# EAGLE design TA kontroller (EAGLE 6.2)
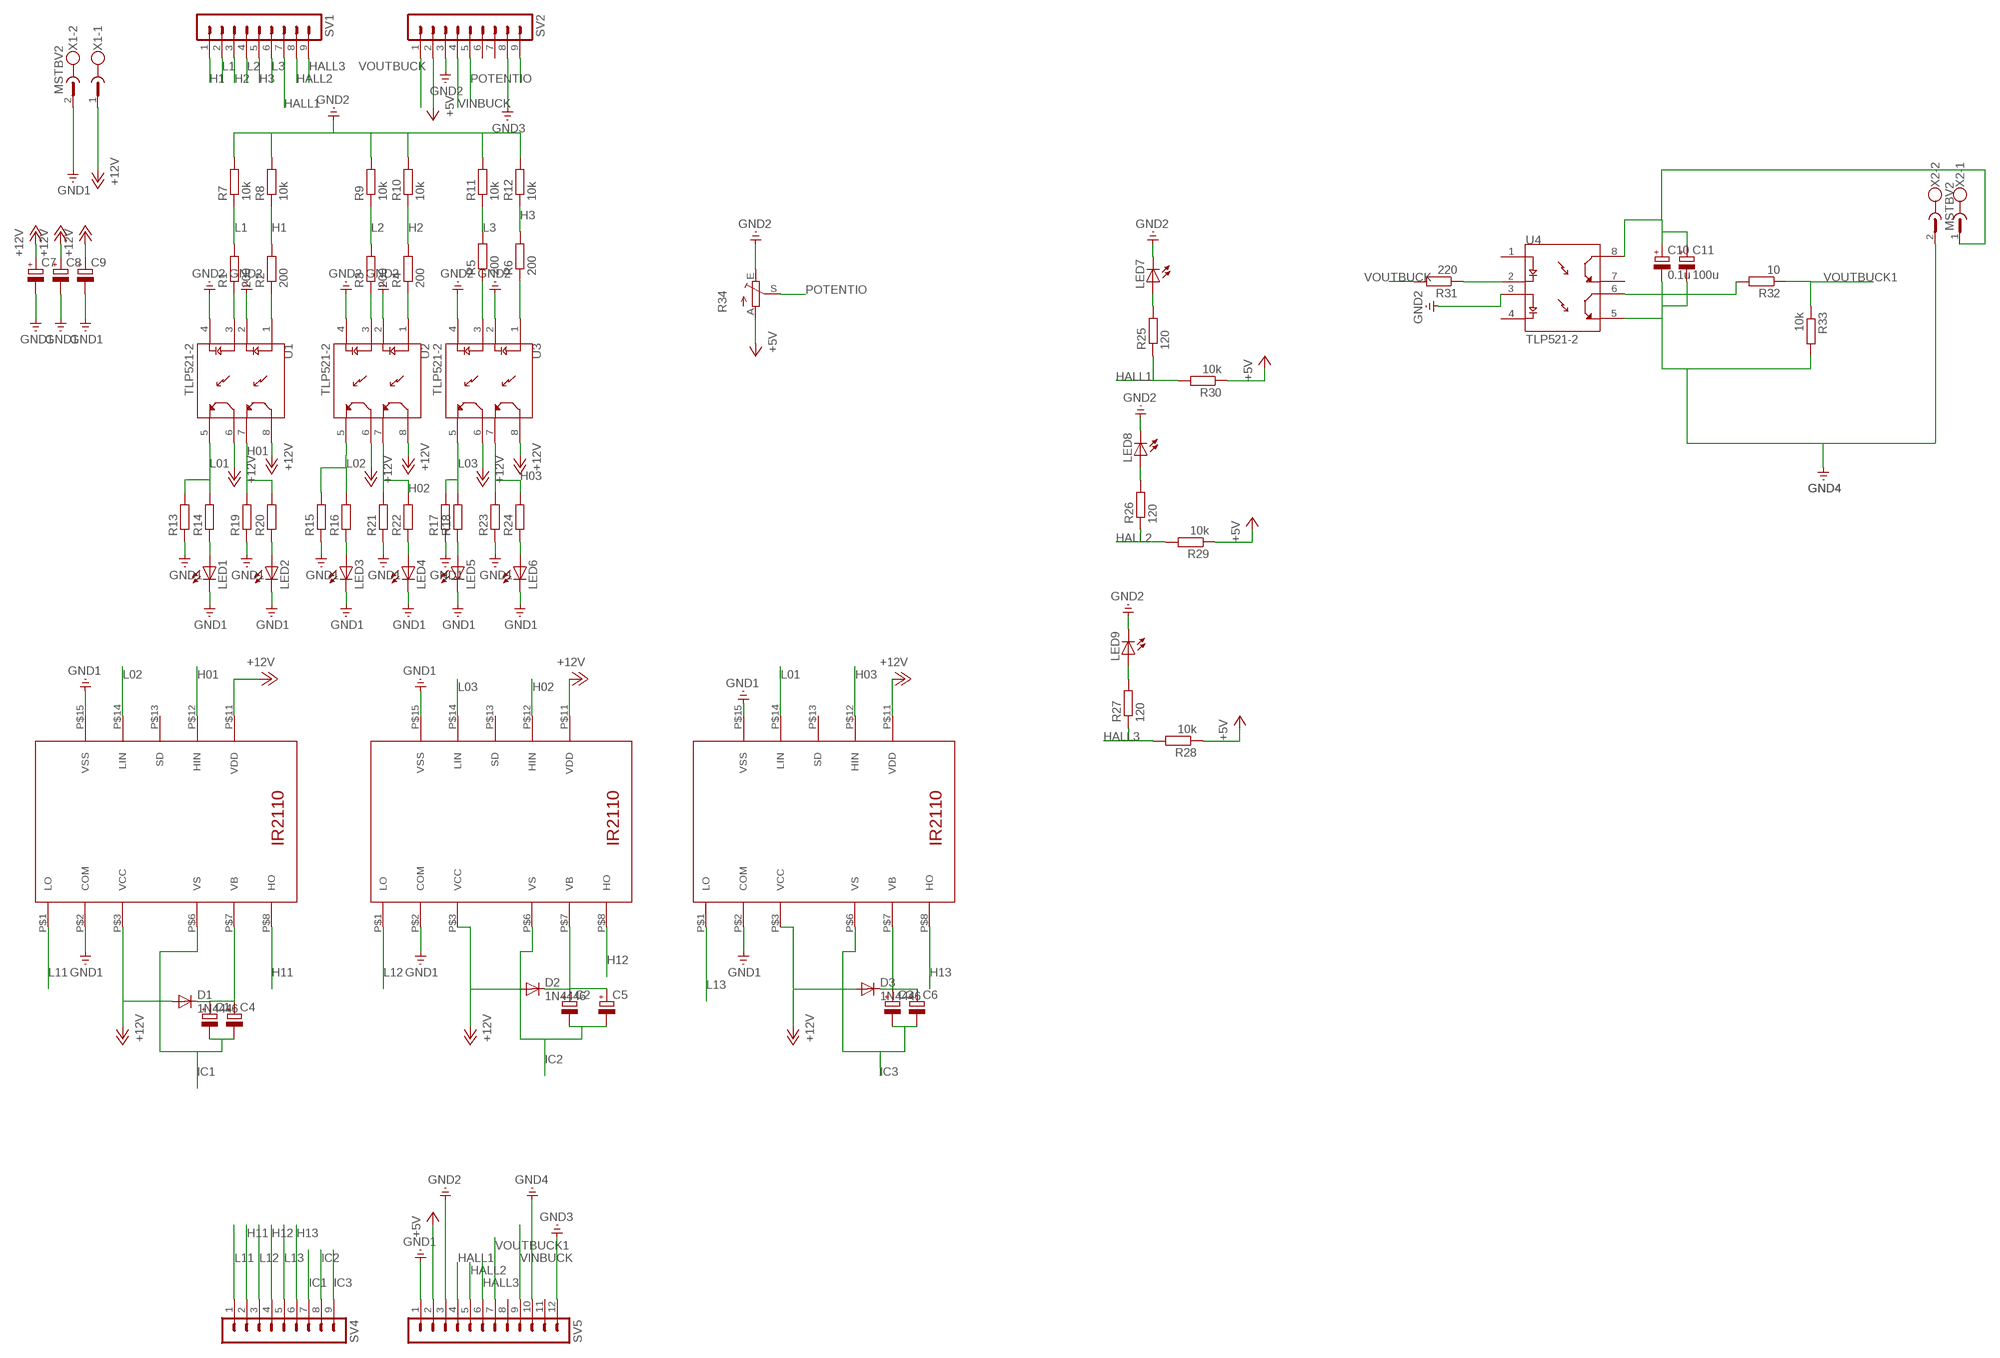
[diagram p0: schematic, sheet 1]

## Parts
C1  CPOL-EUB45181C  [B45181C]
C2  CPOL-EUB45181C  [B45181C]
C3  CPOL-EUB45181C  [B45181C]
C4  CPOL-EUB45181C  [B45181C]
C5  CPOL-EUB45181C  [B45181C]
C6  CPOL-EUB45181C  [B45181C]
C7  CPOL-EUB45181C  [B45181C]
C8  CPOL-EUB45181C  [B45181C]
C9  CPOL-EUB45181C  [B45181C]
C10  0.1u  CPOL-EUB45181C  [B45181C]
C11  100u  CPOL-EUB45181C  [B45181C]
D1  1N4446  [DO35-10]
D2  1N4446  [DO35-10]
D3  1N4446  [DO35-10]
LED1  LED3MM  [LED3MM]
LED2  LED3MM  [LED3MM]
LED3  LED3MM  [LED3MM]
LED4  LED3MM  [LED3MM]
LED5  LED3MM  [LED3MM]
LED6  LED3MM  [LED3MM]
LED7  LED3MM  [LED3MM]
LED8  LED3MM  [LED3MM]
LED9  LED3MM  [LED3MM]
R1  200  R-EU_0207/12  [0207/12]
R2  200  R-EU_0207/12  [0207/12]
R3  200  R-EU_0207/12  [0207/12]
R4  200  R-EU_0207/12  [0207/12]
R5  200  R-EU_0207/12  [0207/12]
R6  200  R-EU_0207/12  [0207/12]
R7  10k  R-EU_0207/12  [0207/12]
R8  10k  R-EU_0207/12  [0207/12]
R9  10k  R-EU_0207/12  [0207/12]
R10  10k  R-EU_0207/12  [0207/12]
R11  10k  R-EU_0207/12  [0207/12]
R12  10k  R-EU_0207/12  [0207/12]
R13  R-EU_0207/12  [0207/12]
R14  R-EU_0207/12  [0207/12]
R15  R-EU_0207/12  [0207/12]
R16  R-EU_0207/12  [0207/12]
R17  R-EU_0207/12  [0207/12]
R18  R-EU_0207/12  [0207/12]
R19  R-EU_0207/12  [0207/12]
R20  R-EU_0207/12  [0207/12]
R21  R-EU_0207/12  [0207/12]
R22  R-EU_0207/12  [0207/12]
R23  R-EU_0207/12  [0207/12]
R24  R-EU_0207/12  [0207/12]
R25  120  R-EU_0207/12  [0207/12]
R26  120  R-EU_0207/12  [0207/12]
R27  120  R-EU_0207/12  [0207/12]
R28  10k  R-EU_0207/12  [0207/12]
R29  10k  R-EU_0207/12  [0207/12]
R30  10k  R-EU_0207/12  [0207/12]
R31  220  R-EU_0207/12  [0207/12]
R32  10  R-EU_0207/12  [0207/12]
R33  10k  R-EU_0207/12  [0207/12]
R34  TRIM_EU-B25V  [B25V]
SV1  MA09-1  [MA09-1]
SV2  MA09-1  [MA09-1]
SV4  MA09-1  [MA09-1]
SV5  MA12-1  [MA12-1]
U1  TLP521-2  [DIP762W50P254L1018H451Q8]
U2  TLP521-2  [DIP762W50P254L1018H451Q8]
U3  TLP521-2  [DIP762W50P254L1018H451Q8]
U4  TLP521-2  [DIP762W50P254L1018H451Q8]
U$1  IR2110  [DIL16]
U$2  IR2110  [DIL16]
U$3  IR2110  [DIL16]
X1  MSTBV2  [MSTBV2]
X2  MSTBV2  [MSTBV2]

## Nets
+5V: R28.1 R29.1 R30.1 R34.A SV2.2 SV5.2
+12V: C7.+ C8.+ C9.+ D1.A D2.A D3.A U1.6 U1.8 U2.6 U2.8 U3.6 U3.8 U$1.P$3(VCC) U$1.P$11(VDD) U$2.P$3(VCC) U$2.P$11(VDD) U$3.P$3(VCC) U$3.P$11(VDD) X1.1
GND1: C7.- C8.- C9.- LED1.K(C) LED2.K(C) LED3.K(C) LED4.K(C) LED5.K(C) LED6.K(C) R13.1 R15.1 R17.1 R19.1 R21.1 R23.1 SV5.1 U$1.P$2(COM) U$1.P$15(VSS) U$2.P$2(COM) U$2.P$15(VSS) U$3.P$2(COM) U$3.P$15(VSS) X1.2
GND2: LED7.K(C) LED8.K(C) LED9.K(C) R7.2 R8.2 R9.2 R10.2 R11.2 R12.2 R34.E SV2.3 SV5.3 U1.2 U1.4 U2.2 U2.4 U3.2 U3.4 U4.3
GND3: SV2.8 SV5.12
GND4: C10.- C11.- R33.2 SV5.10 U4.5 X2.2
H1: R2.2 R8.1 SV1.1
H01: R19.2 R20.2 U1.7 U$1.P$12(HIN)
H2: R4.2 R10.1 SV1.3
H02: R21.2 R22.2 U2.7 U$2.P$12(HIN)
H3: R6.2 R12.1 SV1.5
H03: R23.2 R24.2 U3.7 U$3.P$12(HIN)
H11: SV4.2 U$1.P$8(HO)
H12: SV4.4 U$2.P$8(HO)
H13: SV4.6 U$3.P$8(HO)
HALL1: R25.1 R30.2 SV1.7 SV5.4
HALL2: R26.1 R29.2 SV1.8 SV5.5
HALL3: R27.1 R28.2 SV1.9 SV5.6
IC1: C1.- C4.- SV4.7 U$1.P$6(VS)
IC2: C2.- C5.- SV4.8 U$2.P$6(VS)
IC3: C3.- C6.- SV4.9 U$3.P$6(VS)
L1: R1.2 R7.1 SV1.2
L01: R13.2 R14.2 U1.5 U$3.P$14(LIN)
L2: R3.2 R9.1 SV1.4
L02: R15.2 R16.2 U2.5 U$1.P$14(LIN)
L3: R5.2 R11.1 SV1.6
L03: R17.2 R18.2 U3.5 U$2.P$14(LIN)
L11: SV4.1 U$1.P$1(LO)
L12: SV4.3 U$2.P$1(LO)
L13: SV4.5 U$3.P$1(LO)
N$1: R2.1 U1.1
N$2: R4.1 U2.1
N$3: R32.2 U4.6
N$4: R5.1 U3.3
N$5: R6.1 U3.1
N$6: LED1.A R14.1
N$7: LED2.A R20.1
N$8: LED3.A R16.1
N$9: LED4.A R22.1
N$10: R3.1 U2.3
N$11: R1.1 U1.3
N$12: LED5.A R18.1
N$13: LED6.A R24.1
N$14: R31.1 U4.2
N$15: C2.+ C5.+ D2.C U$2.P$7(VB)
N$16: C1.+ C4.+ D1.C U$1.P$7(VB)
N$17: C3.+ C6.+ D3.C U$3.P$7(VB)
N$18: LED9.A R27.2
N$19: LED8.A R26.2
N$20: LED7.A R25.2
POTENTIO: R34.S SV2.5
V2: C10.+ C11.+ SV2.9 U4.8 X2.1
VINBUCK: SV2.4 SV5.9
VOUTBUCK: R31.2 SV2.1
VOUTBUCK1: R32.1 R33.1 SV5.7
Unconnected: SV2.6 SV2.7 SV5.8 SV5.11 U4.1 U4.4 U4.7 U$1.P$13(SD) U$2.P$13(SD) U$3.P$13(SD)

## Library data of the parts
C1-C11 = rcl:CPOL-EU: POLARIZED CAPACITOR, European symbol
D1-D3 = diode:1N4446: DIODE high speed (Philips)
LED1-LED9 = led:LED: LED OSRAM: - CHIPLED LG R971, LG N971, LY N971, LG Q971, LY Q971, LO R971, LY R971 LH N974, LH R974 LS Q976, LO Q976, LY Q976 LO Q996 - Hyper CHIPLED LW Q18S LB Q993, LB Q99A, LB R99A - SideLED LS A670, LO A670, LY A670, LG A670, LP A670 LB A673, LV A673, LT A673, LW A673 LH A674 LY A675 LS A676, LA A676, LO A676, LY A676, LW A676 LS A679, LY A679, LG A679 - Hyper Micro SIDELED® LS Y876, LA Y876, LO Y876, LY Y876 LT Y87S - SmartLED LW L88C, LW L88S LB L89C, LB L89S, LG L890 LS L89K, LO L89K, LY L89K LS L896, LA L896, LO L896, LY L896 - TOPLED LS T670, LO T670, LY T670, LG T670, LP T670 LSG T670, LSP T670, LSY T670, LOP T670, LYG T670 LG T671, LOG T671, LSG T671 LB T673, LV T673, LT T673, LW T673 LH T674 LS T676, LA T676, LO T676, LY T676, LB T676, LH T676, LSB T676, LW T676 LB T67C, LV T67C, LT T67C, LS T67K, LO T67K, LY T67K, LW E67C LS E67B, LA E67B, LO E67B, LY E67B, LB E67C, LV E67C, LT E67C LW T67C LS T679, LY T679, LG T679 LS T770, LO T770, LY T770, LG T770, LP T770 LB T773, LV T773, LT T773, LW T773 LH T774 LS E675, LA E675, LY E675, LS T675 LS T776, LA T776, LO T776, LY T776, LB T776 LHGB T686 LT T68C, LB T68C - Hyper Mini TOPLED® LB M676 - Mini TOPLED Santana® LG M470 LS M47K, LO M47K, LY M47K Source: http://www.osram.convergy.de LUXEON: - LUMILED® LXK2-PW12-R00, LXK2-PW12-S00, LXK2-PW14-U00, LXK2-PW14-V00 LXK2-PM12-R00, LXK2-PM12-S00, LXK2-PM14-U00 LXK2-PE12-Q00, LXK2-PE12-R00, LXK2-PE12-S00, LXK2-PE14-T00, LXK2-PE14-U00 LXK2-PB12-K00, LXK2-PB12-L00, LXK2-PB12-M00, LXK2-PB14-N00, LXK2-PB14-P00, LXK2-PB14-Q00 LXK2-PR12-L00, LXK2-PR12-M00, LXK2-PR14-Q00, LXK2-PR14-R00 LXK2-PD12-Q00, LXK2-PD12-R00, LXK2-PD12-S00 LXK2-PH12-R00, LXK2-PH12-S00 LXK2-PL12-P00, LXK2-PL12-Q00, LXK2-PL12-R00 Source: www.luxeon.com KINGBRIGHT: KA-3528ASYC Source: www.kingbright.com
R1-R33 = rcl:R-EU_: RESISTOR, European symbol
R34 = pot:TRIM_EU-: POTENTIOMETER
SV1 SV2 SV4 = con-lstb:MA09-1: PIN HEADER; OC_FARNELL: unknown; OC_NEWARK: unknown
SV5 = con-lstb:MA12-1: PIN HEADER; OC_FARNELL: unknown; OC_NEWARK: unknown
U1-U4 = TLP521-2:TLP521-2: DIP-8 10 mm Leads Dual Channel 55 V 5300 Vrms Phototransistor Optocoupler; AVAILABILITY: Unavailable; DESCRIPTION: Optocoupler; THT; Channels: 2; Out: transistor; Uinsul: 5.3kV; DIP8; MF: Isocom; MP: TLP521-2; PACKAGE: DIP-8 Isocom; PRICE: None
U$1-U$3 = jfw-pwm1:IR2110
X1 X2 = con-phoenix-508:MSTBV2: PHOENIX; MPN: MSTBV 2,5/2-GF-5.08; OC_FARNELL: 1792792; OC_NEWARK: 69R9845

## Board
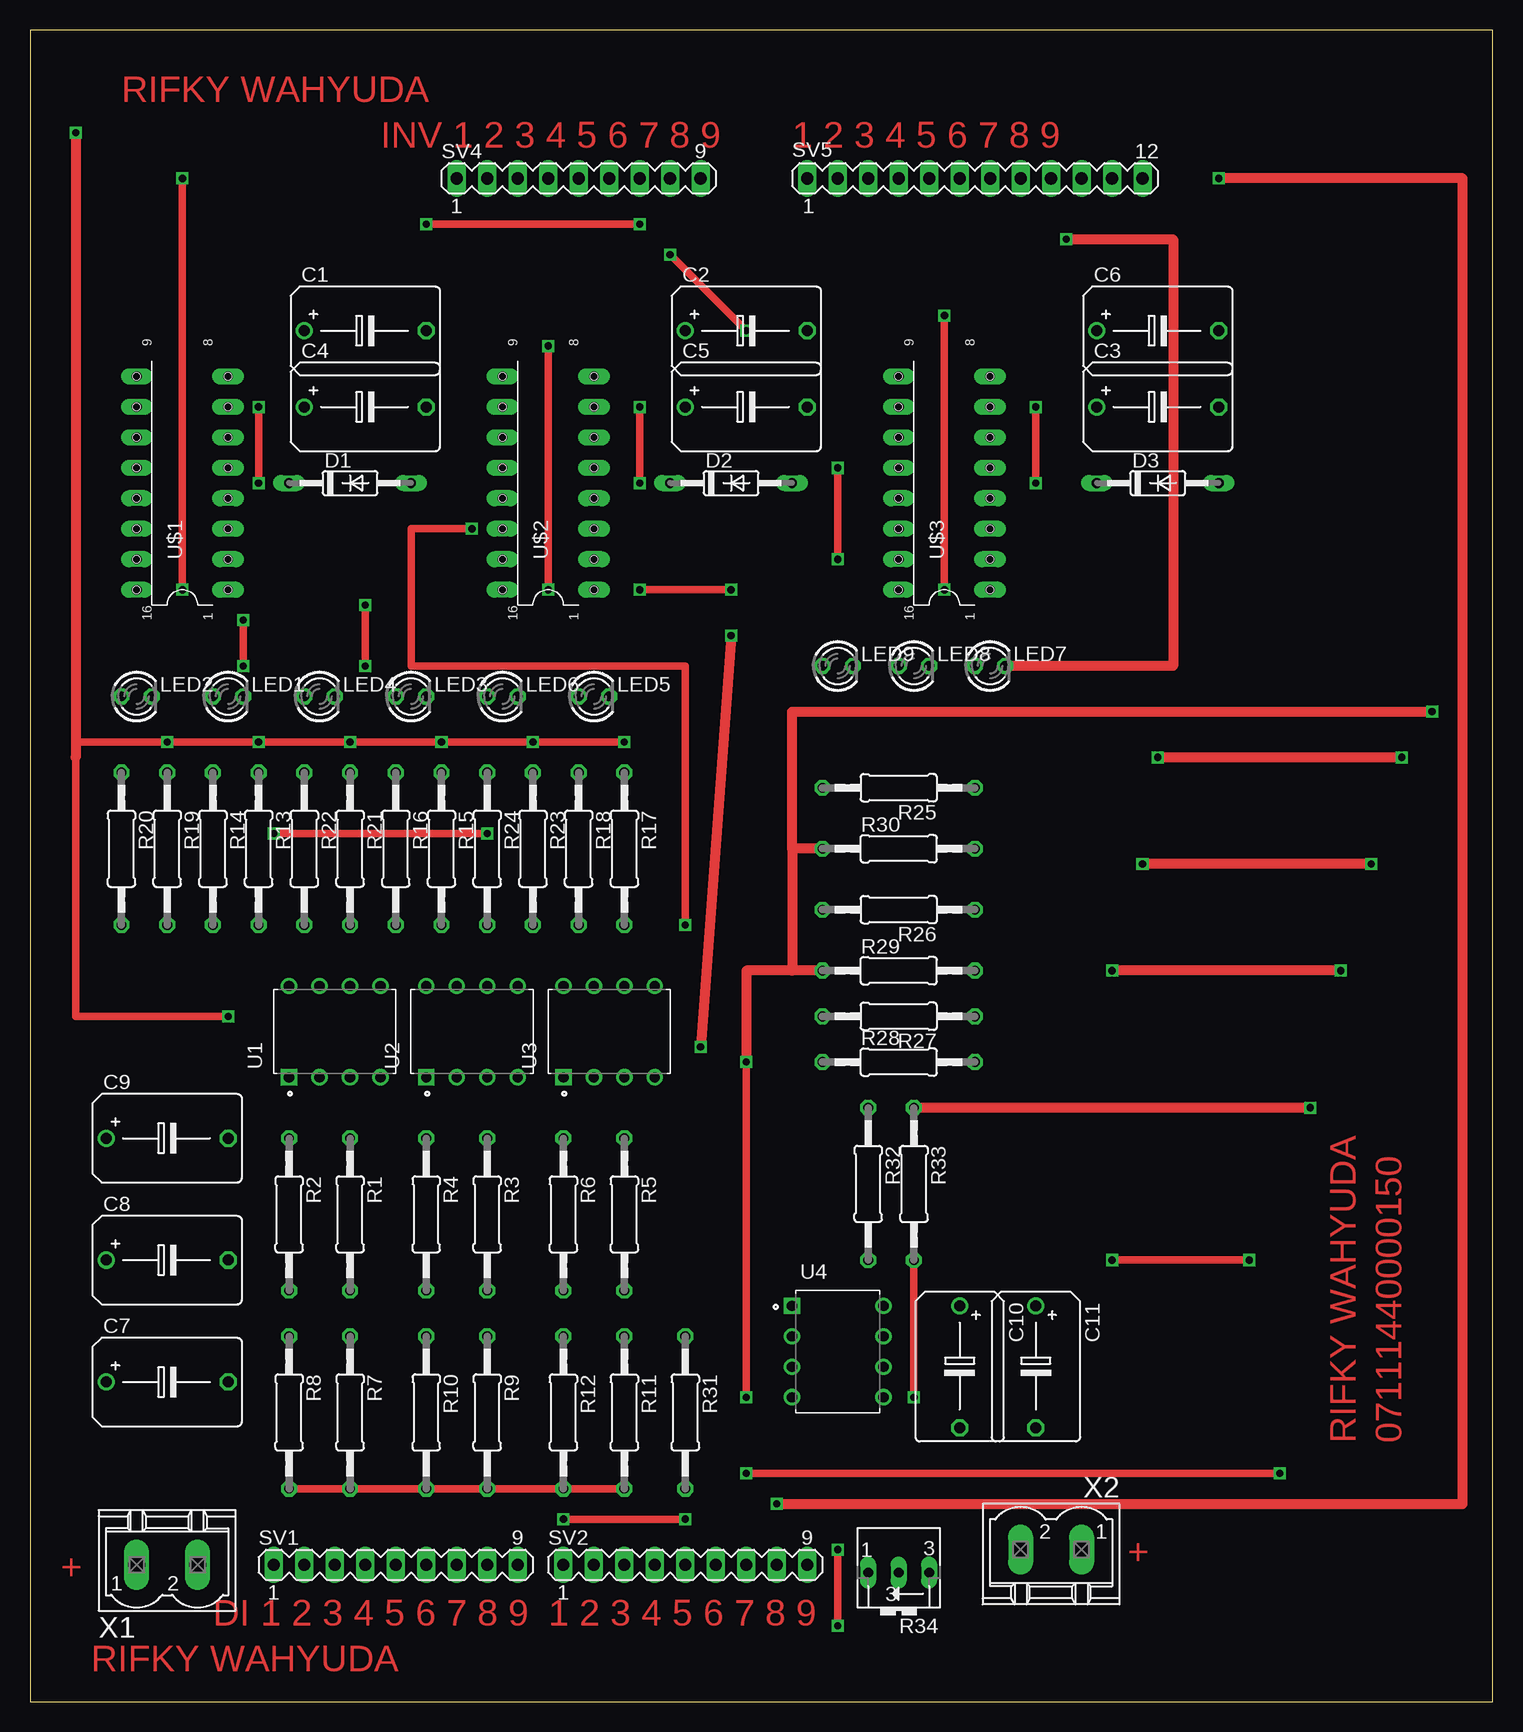
[diagram p1: board, top side]
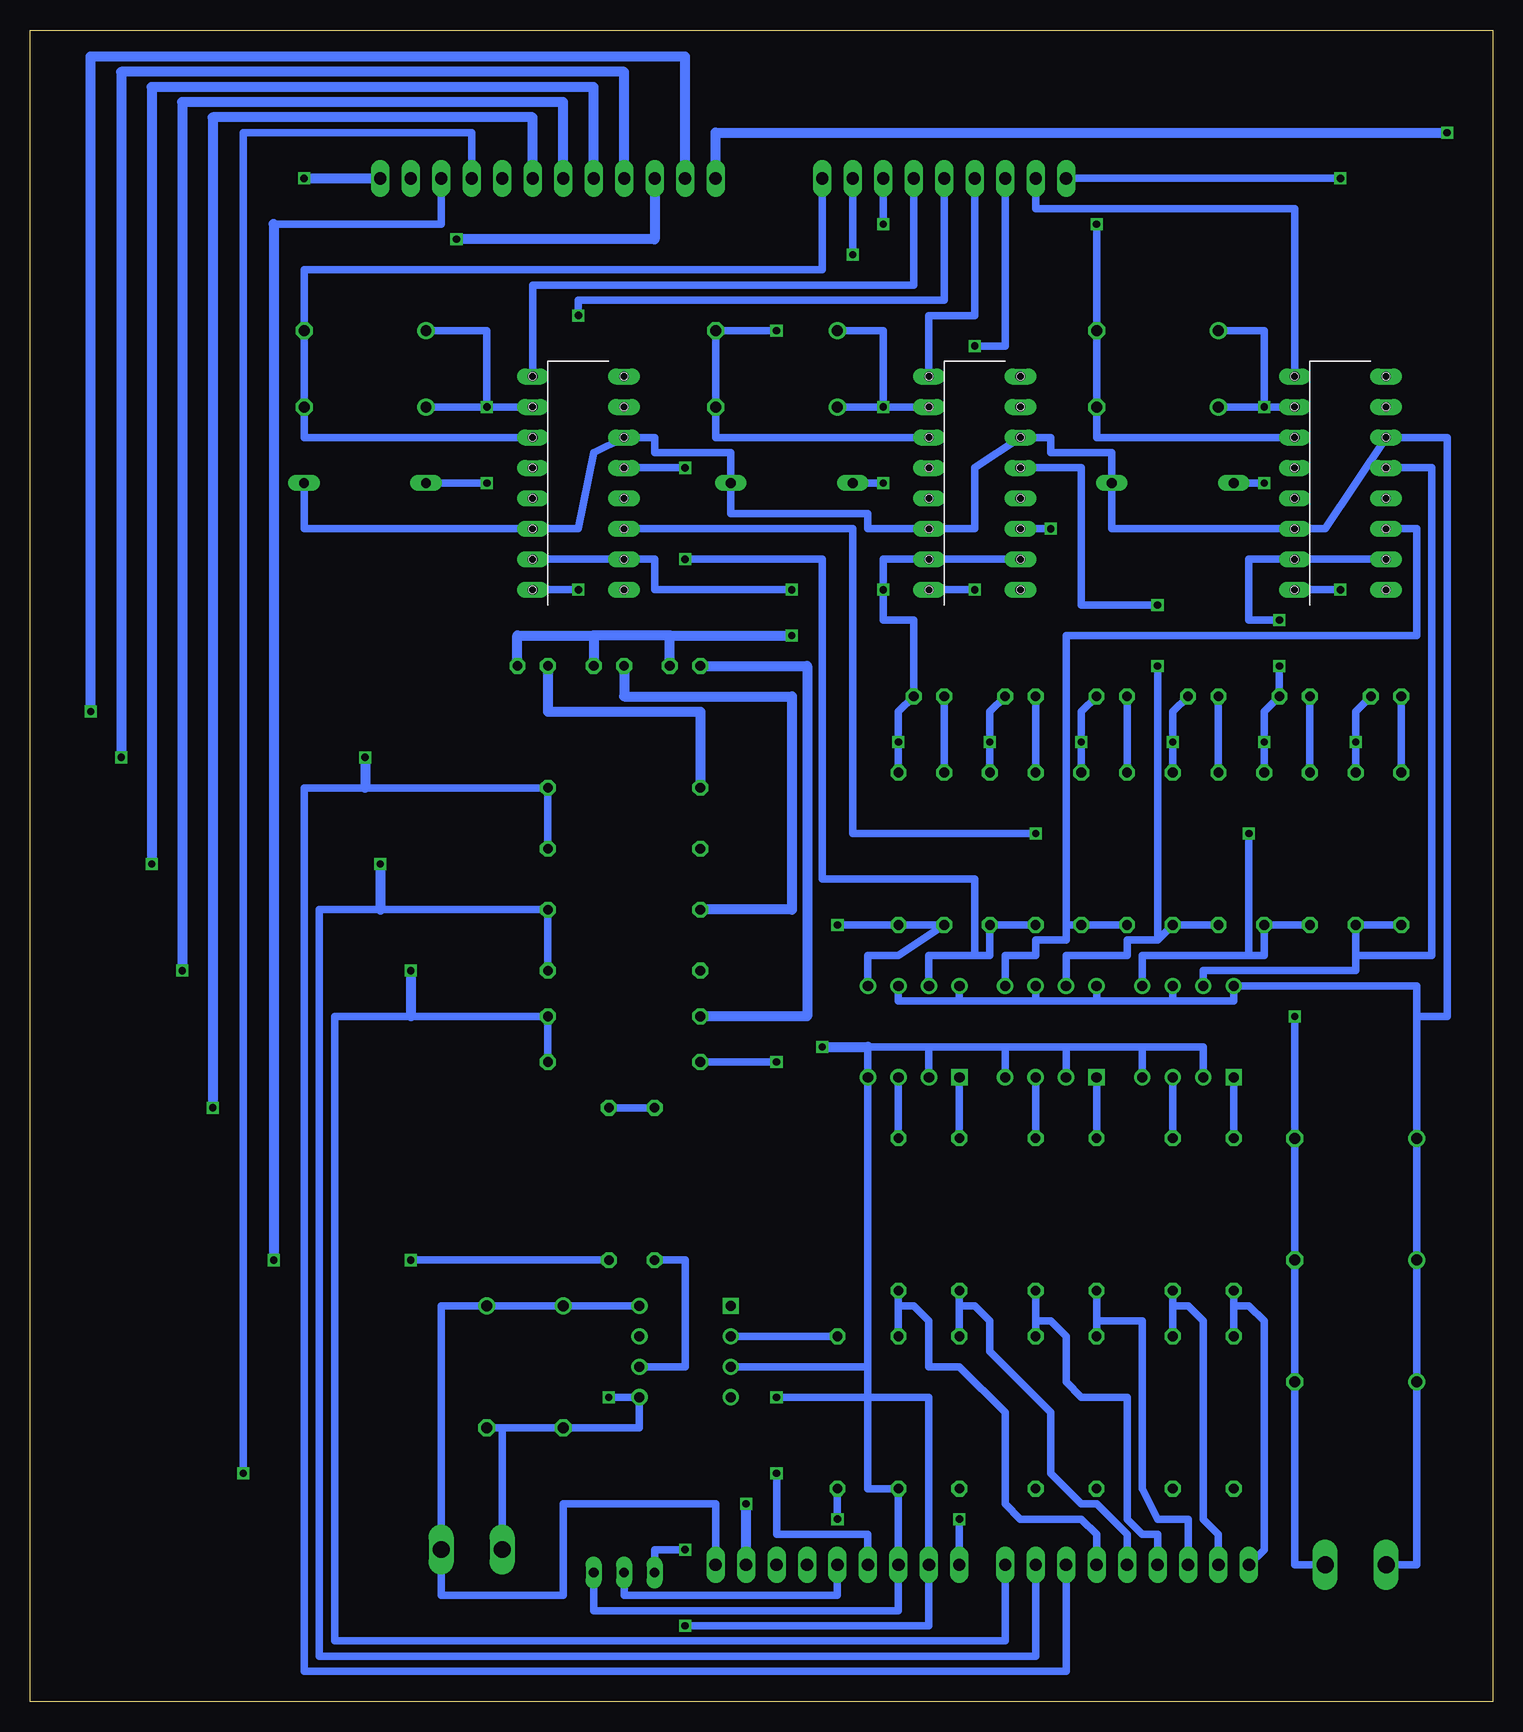
[diagram p2: board, bottom side, seen from below]

Size 121.9 x 139.37 mm. Coordinates in mm from the lower left corner, seen from the top.
Outline: 0,0 121.9,0 121.9,139.37 0,139.37 0,0
Copper layers (1*16): Top 0.035mm / dielectric 1.5mm / Bottom 0.035mm
Design rules: minimum track width 10mil, minimum drill 24mil, track to track 8mil, track to pad 8mil, pad to pad 8mil, via to via 8mil, smd to smd 8mil, copper to edge 40mil, drill to drill 8mil, minimum pad ring 10mil, minimum via ring 8mil, stop-mask expansion 4mil, vias tented up to drill 0mil, thermal gap 10mil

### Footprints (pad centres in the part's own frame; a part is rotated, then mirrored left to right if it is on the bottom)
B45181C = drill 0.914: + -5.08,0 | drill 0.914 octagon: - 5.08,0
DO35-10 = drill 0.813 long: A 5.08,0; C -5.08,0
LED3MM = drill 0.813 octagon: A -1.27,0; K 1.27,0
0207/12 = drill 0.813 octagon: 1 -6.35,0; 2 6.35,0
B25V = drill 0.813 long: A 2.54,0.635; E -2.54,0.635; S 0,0.635
MA09-1 = drill 1.016 long: 1 -10.16,0; 2 -7.62,0; 3 -5.08,0; 4 -2.54,0; 5 0,0; 6 2.54,0; 7 5.08,0; 8 7.62,0; 9 10.16,0
MA12-1 = drill 1.016 long: 1 -13.97,0; 2 -11.43,0; 3 -8.89,0; 4 -6.35,0; 5 -3.81,0; 6 -1.27,0; 7 1.27,0; 8 3.81,0; 9 6.35,0; 10 8.89,0; 11 11.43,0; 12 13.97,0
DIP762W50P254L1018H451Q8 = drill 0.85 pad 1.35 square: 1 -3.81,3.81 | drill 0.85 pad 1.35: 2 -3.81,1.27; 3 -3.81,-1.27; 4 -3.81,-3.81; 5 3.81,-3.81; 6 3.81,-1.27; 7 3.81,1.27; 8 3.81,3.81
DIL16 = drill 0.813 long: P$1 -8.89,-3.81; P$2 -6.35,-3.81; P$3 -3.81,-3.81; P$4 -1.27,-3.81; P$5 1.27,-3.81; P$6 3.81,-3.81; P$7 6.35,-3.81; P$8 8.89,-3.81; P$9 8.89,3.81; P$10 6.35,3.81; P$11 3.81,3.81; P$12 1.27,3.81; P$13 -1.27,3.81; P$14 -3.81,3.81; P$15 -6.35,3.81; P$16 -8.89,3.81 | hole 0.61: -6.35,3.81; -3.81,3.81; -1.27,3.81; 1.27,3.81; 3.81,3.81; 6.35,3.81; 8.89,3.81; 8.89,-3.81; 6.35,-3.81; 3.81,-3.81; 1.27,-3.81; -1.27,-3.81; -3.81,-3.81; -6.35,-3.81; -8.89,-3.81; -8.89,3.81
MSTBV2 = drill 1.397 long: 1 -2.54,0; 2 2.54,0

### Placement (x,y rotation side)
C1  27.94,114.3 0 top
C2  59.69,114.3 0 top
C3  93.98,107.95 0 top
C4  27.94,107.95 0 top
C5  59.69,107.95 0 top
C6  93.98,114.3 0 top
C7  11.43,26.67 0 top
C8  11.43,36.83 0 top
C9  11.43,46.99 0 top
C10  77.47,27.94 270 top
C11  83.82,27.94 270 top
D1  26.67,101.6 0 top
D2  58.42,101.6 0 top
D3  93.98,101.6 0 top
LED1  16.51,83.82 0 top
LED2  8.89,83.82 0 top
LED3  31.75,83.82 0 top
LED4  24.13,83.82 0 top
LED5  46.99,83.82 0 top
LED6  39.37,83.82 0 top
LED7  80.01,86.36 0 top
LED8  73.66,86.36 0 top
LED9  67.31,86.36 0 top
R1  26.67,40.64 270 top
R2  21.59,40.64 270 top
R3  38.1,40.64 270 top
R4  33.02,40.64 270 top
R5  49.53,40.64 270 top
R6  44.45,40.64 270 top
R7  26.67,24.13 270 top
R8  21.59,24.13 270 top
R9  38.1,24.13 270 top
R10  33.02,24.13 270 top
R11  49.53,24.13 270 top
R12  44.45,24.13 270 top
R13  19.05,71.12 270 top
R14  15.24,71.12 270 top
R15  34.29,71.12 270 top
R16  30.48,71.12 270 top
R17  49.53,71.12 270 top
R18  45.72,71.12 270 top
R19  11.43,71.12 270 top
R20  7.62,71.12 270 top
R21  26.67,71.12 270 top
R22  22.86,71.12 270 top
R23  41.91,71.12 270 top
R24  38.1,71.12 270 top
R25  72.39,76.2 180 top
R26  72.39,66.04 180 top
R27  72.39,57.15 180 top
R28  72.39,53.34 0 top
R29  72.39,60.96 0 top
R30  72.39,71.12 0 top
R31  54.61,24.13 270 top
R32  69.85,43.18 270 top
R33  73.66,43.18 270 top
R34  72.39,11.43 180 top
SV1  30.48,11.43 0 top
SV2  54.61,11.43 0 top
SV4  45.72,127 0 top
SV5  78.74,127 0 top
U1  25.4,55.88 90 top
U2  36.83,55.88 90 top
U3  48.26,55.88 90 top
U4  67.31,29.21 0 top
U$1  12.7,101.6 90 top
U$2  43.18,101.6 90 top
U$3  76.2,101.6 90 top
X1  11.43,11.43 0 top
X2  85.09,12.7 180 top

### Tracks (layer width: path | path; a pad name or v marks a point on that pad's centre or on a via)
+5V  (via drill 0.6)
  Top 0.61: v67.31,12.7 v67.31,6.35 | v59.69,25.4 v59.69,53.34
  Top 0.813: R29.1 63.5,60.96 | 63.5,60.96 59.69,60.96 v59.69,53.34 | 63.5,71.12 63.5,60.96 | R30.1 63.5,71.12 | 63.5,71.12 63.5,82.55 v116.84,82.55
  Bottom 0.61: R34.A 69.85,12.7 v67.31,12.7 | v67.31,6.35 46.99,6.35 SV2.2 46.99,25.4 v59.69,25.4 | v59.69,53.34 R28.1
  Bottom 0.813: SV5.2 67.31,137.16 116.84,137.16 v116.84,82.55
+12V
  Bottom 0.61: X1.1 6.35,11.43 C7.+ C8.+ C9.+ 6.35,57.15 | 6.35,57.15 6.35,59.69 U1.8 21.59,58.42 26.67,58.42 | 26.67,58.42 U1.6 | U2.8 33.02,58.42 | 33.02,58.42 26.67,58.42 | U2.6 38.1,58.42 | 38.1,58.42 33.02,58.42 | U3.8 44.45,58.42 | 44.45,58.42 38.1,58.42 | U3.6 49.53,58.42 44.45,58.42 | 6.35,57.15 3.81,57.15 3.81,105.41 U$1.P$11 13.97,97.79 U$1.P$3 31.75,97.79 D1.A 31.75,104.14 36.83,104.14 36.83,105.41 U$2.P$11 43.18,102.87 43.18,97.79 U$2.P$3 52.07,97.79 52.07,99.06 63.5,99.06 D2.A 63.5,104.14 69.85,104.14 69.85,105.41 U$3.P$11 74.93,104.14 76.2,97.79 U$3.P$3 99.06,97.79 D3.A
GND1  (via drill 0.6)
  Top 0.61: v16.51,57.15 3.81,57.15 3.81,78.74 3.81,80.01 v11.43,80.01 v19.05,80.01 v26.67,80.01 v34.29,80.01 v41.91,80.01 v49.53,80.01 | v17.78,86.36 v17.78,90.17 | v58.42,92.71 v50.8,92.71
  Top 0.813: v3.81,130.81 3.81,78.74
  Bottom 0.61: X1.2 16.51,11.43 C7.- C8.- C9.- v16.51,57.15 | U$1.P$15 U$1.P$2 20.32,95.25 20.32,90.17 v17.78,90.17 | R19.1 v11.43,80.01 11.43,82.55 LED2.K | R13.1 v19.05,80.01 19.05,82.55 LED1.K v17.78,86.36 | R21.1 v26.67,80.01 26.67,82.55 LED4.K | R15.1 v34.29,80.01 34.29,82.55 LED3.K | R23.1 v41.91,80.01 41.91,82.55 LED6.K | R17.1 v49.53,80.01 49.53,82.55 LED5.K 48.26,90.17 50.8,90.17 v50.8,92.71 50.8,95.25 U$2.P$2 U$2.P$15 | U$3.P$2 U$3.P$15 69.85,95.25 69.85,92.71 v58.42,92.71
  Bottom 0.813: SV5.1 64.77,130.81 v3.81,130.81
GND2  (via drill 0.6)
  Top 0.61: R8.2 R7.2 R10.2 R9.2 R12.2 R11.2
  Top 0.813: v86.36,121.92 95.25,121.92 95.25,86.36 LED7.K | v58.42,88.9 v55.88,54.61
  Bottom 0.61: R34.E 74.93,7.62 49.53,7.62 SV2.3 R11.2 52.07,17.78 52.07,27.94 | U4.3 52.07,27.94 | 52.07,27.94 U3.4 52.07,54.61 46.99,54.61 | 46.99,54.61 40.64,54.61 | 40.64,54.61 35.56,54.61 | 35.56,54.61 29.21,54.61 | 29.21,54.61 24.13,54.61 U1.2 | U1.4 29.21,54.61 | U2.2 35.56,54.61 | U2.4 40.64,54.61 | U3.2 46.99,54.61
  Bottom 0.813: SV5.3 69.85,121.92 v86.36,121.92 | LED7.K 81.28,88.9 74.93,88.9 | 74.93,88.9 LED8.K | 68.58,88.9 74.93,88.9 | LED9.K 68.58,88.9 | 68.58,88.9 v58.42,88.9 | v55.88,54.61 52.07,54.61
GND3  (via drill 0.6)
  Top 0.813: v62.23,16.51 119.38,16.51 119.38,127 v99.06,127
  Bottom 0.813: SV2.8 v62.23,16.51 | v99.06,127 SV5.12
GND4  (via drill 0.6)
  Top 0.61: v73.66,25.4 R33.2 | v90.17,36.83 v101.6,36.83
  Bottom 0.61: X2.2 82.55,22.86 | 82.55,22.86 C11.- | 82.55,22.86 C10.- 71.12,22.86 U4.5 v73.66,25.4 | R33.2 v90.17,36.83 | 101.6,123.19 87.63,123.19 SV5.10 | v101.6,36.83 101.6,40.64
  Bottom 0.813: 101.6,123.19 v101.6,36.83
H1
  Bottom 0.61: R2.2 21.59,33.02 | 21.59,33.02 R8.1 | SV1.1 19.05,12.7 19.05,31.75 20.32,33.02 21.59,33.02
H01
  Bottom 0.61: 11.43,62.23 R19.2 R20.2 | 11.43,62.23 11.43,60.96 24.13,60.96 U1.7 | U$1.P$12 5.08,102.87 5.08,62.23 11.43,62.23
H2
  Bottom 0.61: R4.2 33.02,31.75 | 33.02,31.75 R10.1 | SV1.3 25.4,15.24 27.94,15.24 29.21,17.78 29.21,31.75 33.02,31.75
H02  (via drill 0.6)
  Top 0.61: v27.94,91.44 v27.94,86.36
  Bottom 0.61: R22.2 R21.2 27.94,63.5 | U2.7 35.56,62.23 30.48,62.23 30.48,63.5 27.94,63.5 | U$2.P$12 34.29,102.87 34.29,91.44 v27.94,91.44 | v27.94,86.36 27.94,63.5
H3
  Bottom 0.61: R6.2 44.45,33.02 | 44.45,33.02 R12.1 | SV1.5 30.48,13.97 33.02,16.51 34.29,16.51 36.83,19.05 36.83,24.13 41.91,29.21 41.91,31.75 43.18,33.02 44.45,33.02
H03  (via drill 0.6)
  Top 0.61: v67.31,102.87 v67.31,95.25
  Bottom 0.61: R24.2 R23.2 41.91,62.23 43.18,62.23 | U3.7 46.99,62.23 43.18,62.23 | U$3.P$12 v67.31,102.87 | v67.31,95.25 55.88,95.25 55.88,68.58 43.18,68.58 43.18,62.23
H11
  Bottom 0.61: SV4.2 38.1,124.46 16.51,124.46 U$1.P$8
H12
  Bottom 0.61: U$2.P$8 46.99,115.57 43.18,115.57 SV4.4
H13
  Bottom 0.61: SV4.6 48.26,118.11 80.01,118.11 U$3.P$8
HALL1  (via drill 0.6)
  Top 0.813: v114.3,78.74 v93.98,78.74
  Bottom 0.61: SV1.7 35.56,2.54 99.06,2.54 99.06,76.2 93.98,76.2 R25.1 R30.2
  Bottom 0.813: SV5.4 72.39,135.89 114.3,135.89 v114.3,78.74 | v93.98,78.74 93.98,76.2
HALL2  (via drill 0.6)
  Top 0.813: v111.76,69.85 v92.71,69.85
  Bottom 0.61: SV1.8 38.1,3.81 97.79,3.81 97.79,66.04 92.71,66.04 R26.1 R29.2
  Bottom 0.813: SV5.5 74.93,134.62 111.76,134.62 v111.76,69.85 | v92.71,69.85 92.71,66.04
HALL3  (via drill 0.6)
  Top 0.813: v109.22,60.96 v90.17,60.96
  Bottom 0.61: SV1.9 40.64,5.08 96.52,5.08 96.52,57.15 90.17,57.15 R27.1 R28.2
  Bottom 0.813: SV5.6 77.47,133.35 109.22,133.35 v109.22,60.96 | v90.17,60.96 90.17,57.15
IC1  (via drill 0.6)
  Top 0.61: v50.8,123.19 v33.02,123.19
  Bottom 0.61: U$1.P$6 33.02,105.41 C4.- C1.- v33.02,123.19 | SV4.7 v50.8,123.19
IC2  (via drill 0.6)
  Top 0.61: v53.34,120.65 v59.69,114.3
  Bottom 0.61: U$2.P$6 64.77,105.41 C5.- C2.- v59.69,114.3 | SV4.8 v53.34,120.65
IC3
  Bottom 0.61: U$3.P$6 99.06,105.41 C3.- C6.- 99.06,119.38 55.88,119.38 SV4.9
L1
  Bottom 0.61: R7.1 26.67,33.02 | 26.67,33.02 R1.2 | SV1.2 22.86,13.97 24.13,15.24 24.13,31.75 25.4,33.02 26.67,33.02
L01  (via drill 0.6)
  Top 0.61: v38.1,72.39 v20.32,72.39
  Bottom 0.61: R14.2 R13.2 19.05,62.23 20.32,62.23 | U1.5 29.21,62.23 20.32,62.23 | U$3.P$14 53.34,97.79 53.34,72.39 v38.1,72.39 | v20.32,72.39 20.32,62.23
L2
  Bottom 0.61: R9.1 38.1,31.75 | 38.1,31.75 R3.2 | SV1.4 27.94,13.97 29.21,13.97 30.48,15.24 30.48,25.4 34.29,25.4 35.56,26.67 35.56,30.48 36.83,31.75 38.1,31.75
L02
  Bottom 0.61: 35.56,64.77 R16.2 R15.2 | 35.56,64.77 35.56,63.5 38.1,63.5 38.1,62.23 40.64,62.23 U2.5 | U$1.P$14 6.35,97.79 6.35,88.9 35.56,88.9 35.56,64.77
L3
  Bottom 0.61: R5.2 49.53,33.02 | 49.53,33.02 R11.1 | SV1.6 33.02,13.97 34.29,15.24 39.37,15.24 40.64,16.51 40.64,24.13 44.45,27.94 46.99,27.94 46.99,31.75 48.26,33.02 49.53,33.02
L03  (via drill 0.6)
  Top 0.61: v54.61,64.77 54.61,86.36 31.75,86.36 31.75,97.79 v36.83,97.79
  Bottom 0.61: U3.5 52.07,62.23 49.53,62.23 R18.2 R17.2 v54.61,64.77 | v36.83,97.79 U$2.P$14
L11  (via drill 0.6)
  Top 0.61: v12.7,92.71 v12.7,127
  Bottom 0.61: U$1.P$1 v12.7,92.71 | v12.7,127 SV4.1
L12  (via drill 0.6)
  Top 0.61: v43.18,92.71 v43.18,113.03
  Bottom 0.61: U$2.P$1 v43.18,92.71 | v43.18,113.03 40.64,113.03 SV4.3
L13  (via drill 0.6)
  Top 0.61: v76.2,92.71 v76.2,115.57
  Bottom 0.61: U$3.P$1 v76.2,92.71 | v76.2,115.57 76.2,116.84 45.72,116.84 SV4.5
N$1
  Bottom 0.61: R2.1 U1.1
N$2
  Bottom 0.61: R4.1 U2.1
N$3
  Bottom 0.61: R32.2 67.31,36.83 67.31,27.94 U4.6
N$4
  Bottom 0.61: U3.3 R5.1
N$5
  Bottom 0.61: R6.1 U3.1
N$6
  Bottom 0.61: R14.1 LED1.A
N$7
  Bottom 0.61: R20.1 LED2.A
N$8
  Bottom 0.61: R16.1 LED3.A
N$9
  Bottom 0.61: LED4.A R22.1
N$10
  Bottom 0.61: R3.1 U2.3
N$11
  Bottom 0.61: R1.1 U1.3
N$12
  Bottom 0.61: R18.1 LED5.A
N$13
  Bottom 0.61: R24.1 LED6.A
N$14
  Bottom 0.61: R31.1 U4.2
N$15  (via drill 0.6)
  Top 0.61: v50.8,101.6 v50.8,107.95
  Bottom 0.61: U$2.P$7 v50.8,107.95 | v50.8,107.95 C5.+ | C2.+ 50.8,114.3 50.8,111.76 v50.8,107.95 | D2.C v50.8,101.6
N$16  (via drill 0.6)
  Top 0.61: v19.05,101.6 v19.05,107.95
  Bottom 0.61: v19.05,107.95 C4.+ | U$1.P$7 v19.05,107.95 | C1.+ 19.05,114.3 19.05,111.76 v19.05,107.95 | D1.C v19.05,101.6
N$17  (via drill 0.6)
  Top 0.61: v83.82,101.6 v83.82,107.95
  Bottom 0.61: U$3.P$7 v83.82,107.95 | v83.82,107.95 C3.+ | C6.+ 83.82,114.3 83.82,111.76 v83.82,107.95 | D3.C v83.82,101.6
N$18
  Bottom 0.813: LED9.A 57.15,86.36 57.15,57.15 R27.2
N$19
  Bottom 0.813: LED8.A 72.39,83.82 58.42,83.82 58.42,66.04 R26.2
N$20
  Bottom 0.813: LED7.A 78.74,82.55 66.04,82.55 R25.2
POTENTIO
  Bottom 0.61: R34.S 72.39,8.89 54.61,8.89 SV2.5
V2
  Bottom 0.61: U4.8 C10.+ C11.+ 87.63,33.02 X2.1 87.63,8.89 77.47,8.89 77.47,16.51 64.77,16.51 SV2.9
VINBUCK  (via drill 0.6)
  Top 0.61: v104.14,19.05 v59.69,19.05
  Bottom 0.61: SV2.4 52.07,13.97 59.69,13.97 v59.69,19.05 | SV5.9 85.09,130.81 104.14,130.81 v104.14,19.05
VOUTBUCK  (via drill 0.6)
  Top 0.61: v44.45,15.24 v54.61,15.24
  Bottom 0.61: SV2.1 v44.45,15.24 | v54.61,15.24 R31.2
VOUTBUCK1  (via drill 0.6)
  Top 0.813: v106.68,49.53 R33.1
  Bottom 0.61: R33.1 R32.1
  Bottom 0.813: SV5.7 80.01,132.08 106.68,132.08 v106.68,49.53

### Text on the board
Top: RIFKY WAHYUDA | INV 1 2 3 4 5 6 7 8 9 | 1 2 3 4 5 6 7 8 9 | RIFKY WAHYUDA | 07111440000150 | + | + | DI 1 2 3 4 5 6 7 8 9 | 1 2 3 4 5 6 7 8 9 | RIFKY WAHYUDA